# Altium schematic sheet DVT-ClockGenerator.SchDoc: DVT Clock Generator
size A4; Revision: 1; SheetNumber: 1; SheetTotal: 1; PartNumber: PN00054; Drawn By: Sebastian Kulik
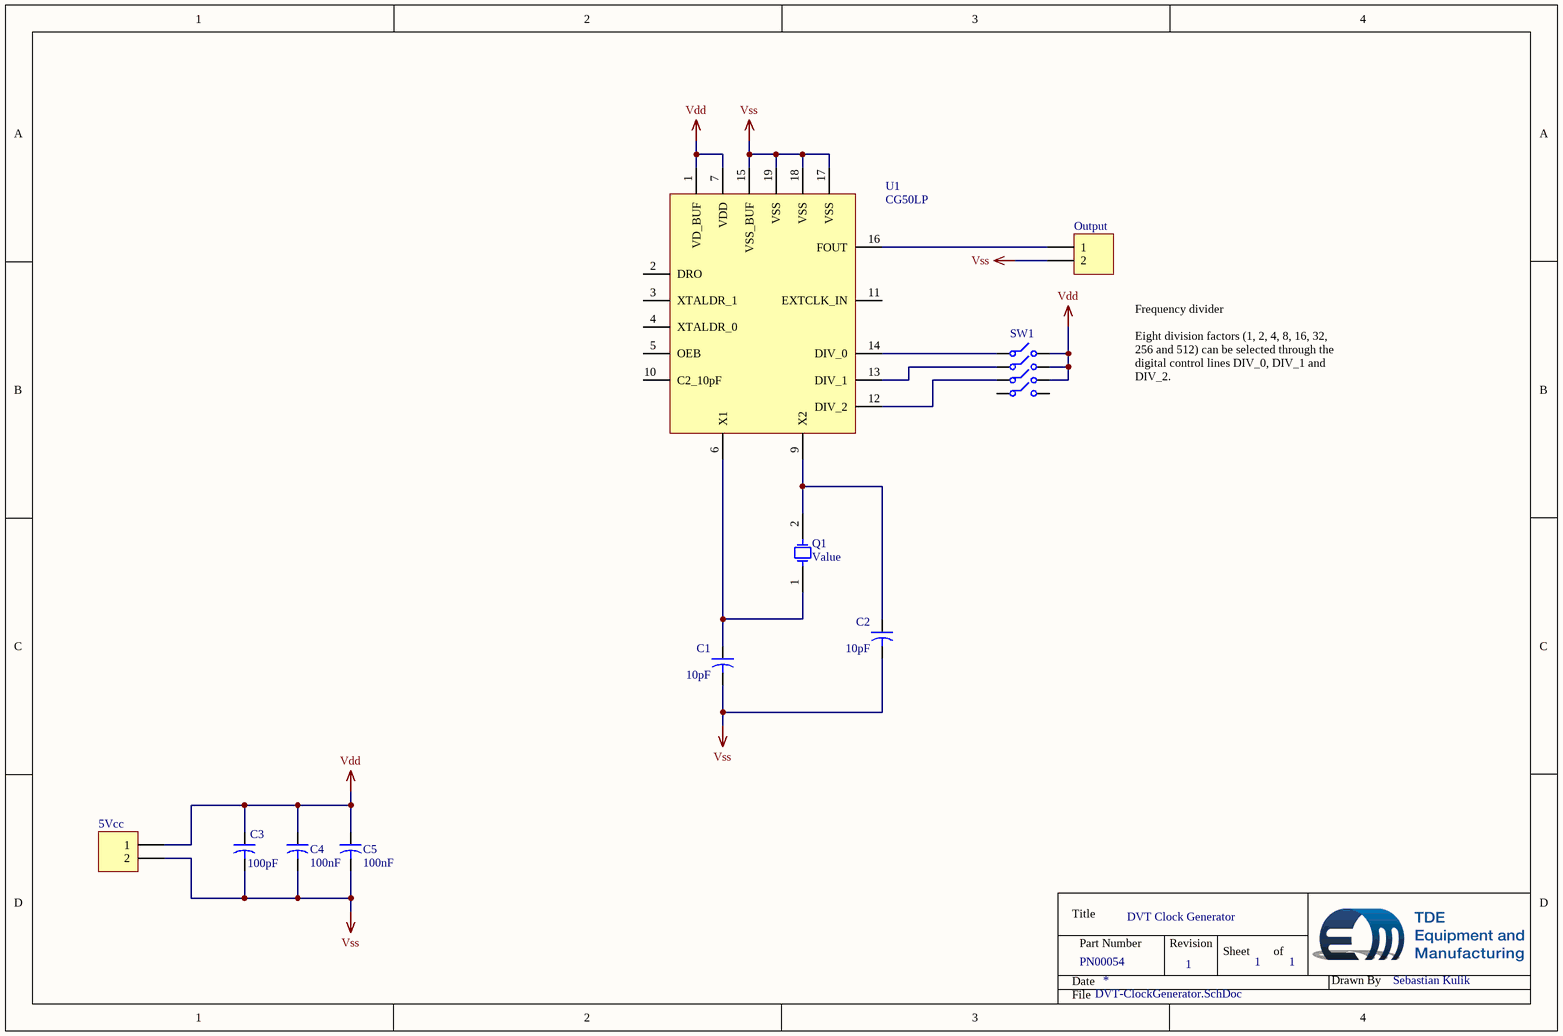
[diagram p0: DVT-ClockGenerator.SchDoc]

## Parts
5Vcc  PHOENIX_1715721  [Phoenix-2-5_08]  (value not drawn)
C1  value 10pF  [Dummy-10mm]  (hidden comment: Capacitor-Dummy-THT)
C2  value 10pF  [Dummy-10mm]  (hidden comment: Capacitor-Dummy-THT)
C3  value 100pF  [Dummy-10mm]  (hidden comment: Capacitor-Dummy-THT)
C4  value 100nF  [Dummy-10mm]  (hidden comment: Capacitor-Dummy-THT)
C5  value 100nF  [Dummy-10mm]  (hidden comment: Capacitor-Dummy-THT)
Output  PHOENIX_1715721  [Phoenix-2-5_08]  (value not drawn)
Q1  Crystal_HC49-U_THT  [HC49-U]  (value not drawn)
SW1  WS-DITV-4DIP  [DIP-8-Ceramic-HT]  (value not drawn)
U1  CG50LP  [TDFP16]

## Nets
Vdd: 5Vcc.1 C3.1 C4.1 C5.1 SW1.6 SW1.7 SW1.8 U1.1(VD_BUF) U1.7(VDD)
Vss: 5Vcc.2 C1.2 C2.2 C3.2 C4.2 C5.2 Output.2 U1.15(VSS_BUF) U1.17(VSS) U1.18(VSS) U1.19(VSS)
NetC1_1: C1.1 Q1.1(E/D) U1.6(X1)
NetC2_1: C2.1 Q1.2(GND) U1.9(X2)
NetOutput_1: Output.1 U1.16(FOUT)
NetSW1_1: SW1.1 U1.14(DIV_0)
NetSW1_2: SW1.2 U1.13(DIV_1)
NetSW1_3: SW1.3 U1.12(DIV_2)

Not connected (* = marked no-connect by the designer): SW1 4 5; U1 2(DRO) 3(XTALDR_1) 4(XTALDR_0) 5(OEB) 10(C2_10pF) 11(EXTCLK_IN)

## Notes on the sheet
- Frequency divider
  Eight division factors (1, 2, 4, 8, 16, 32,
  256 and 512) can be selected through the
  digital control lines DIV_0, DIV_1 and
  DIV_2.
- Title
- Date
- Part Number
- Revision
- Sheet
- of
- Drawn By
- File

## Library data of the parts
5Vcc Output = 2Pol_1715721: Phoenix, 2 pol, 5.08mm, 22A, 715721; Deliverer PartNr: 193-0564; Deliverer: RS; TDE-PN: CON0008; LatestRevisionDate: 02.05.2014; LatestRevisionNote: Re-released for DXP Platform.; Publisher: Sebastian Kulik; Manufacturer PartNr: 1715721; Manufacturer: Phoenix; PackageDescription: Phoenix-2-5_08; Price: 0.976/5
C1 C2 = Capacitor-Dummy-THT: Deliverer PartNr: 2452198; Manufacturer: Kemet; Manufacturer PartNr: C052H100J2G5GA; Deliverer: Farnell; Published: 08.12.2015; Part Description: Capacitor-Dummy-THT; Publisher: Sebastian Kulik; PackageDescription: -; TDE-PN: -; Price: 15.09/1
C3 = Capacitor-Dummy-THT: Deliverer PartNr: 117-344; Deliverer: RS; Published: 08.12.2015; Part Description: Capacitor-Dummy-THT; Publisher: Sebastian Kulik; PackageDescription: -; Manufacturer: -; Manufacturer PartNr: -; TDE-PN: -; Price: 0.09/10
C4 C5 = Capacitor-Dummy-THT: Deliverer PartNr: 721-5240; Deliverer: RS; Published: 08.12.2015; Part Description: Capacitor-Dummy-THT; Publisher: Sebastian Kulik; PackageDescription: -; Manufacturer: -; Manufacturer PartNr: -; TDE-PN: -; Price: 0.081/50
Q1 = Crystal_HC49-U: Crystal_HC49-U Uni; Deliverer: RS; Published: 22.11.2016; PackageDescription: HC-49U; Publisher: Sebastian Kulik; Value: Value
SW1 = WS-DITV-4DIP: 4 way DIP switch; Deliverer PartNr: 418127270904; Deliverer: WE; TDFE-PN: M0015; Published: 20.07.2016; Publisher: Sebastian Kulik; PackageDescription: DIP-8; Manufacturer: WE; Manufacturer PartNr: 418127270904; Value: WS-DITV-4DIP
U1 = CG50LP: VERSATILE CRYSTAL CLOCK GENERATOR - 2ND GEN; Deliverer: CISSOID; TDE-PN: IC0085; Published: 22.11.2016; Deliverer PartNr: CG50LP; PackageDescription: TDFP16; Publisher: Sebastian Kulik; Manufacturer PartNr: CG50LP; Manufacturer: CISSOID; Price: --